# EAGLE design apollobvm_pcb_mill (EAGLE 9.6.0)
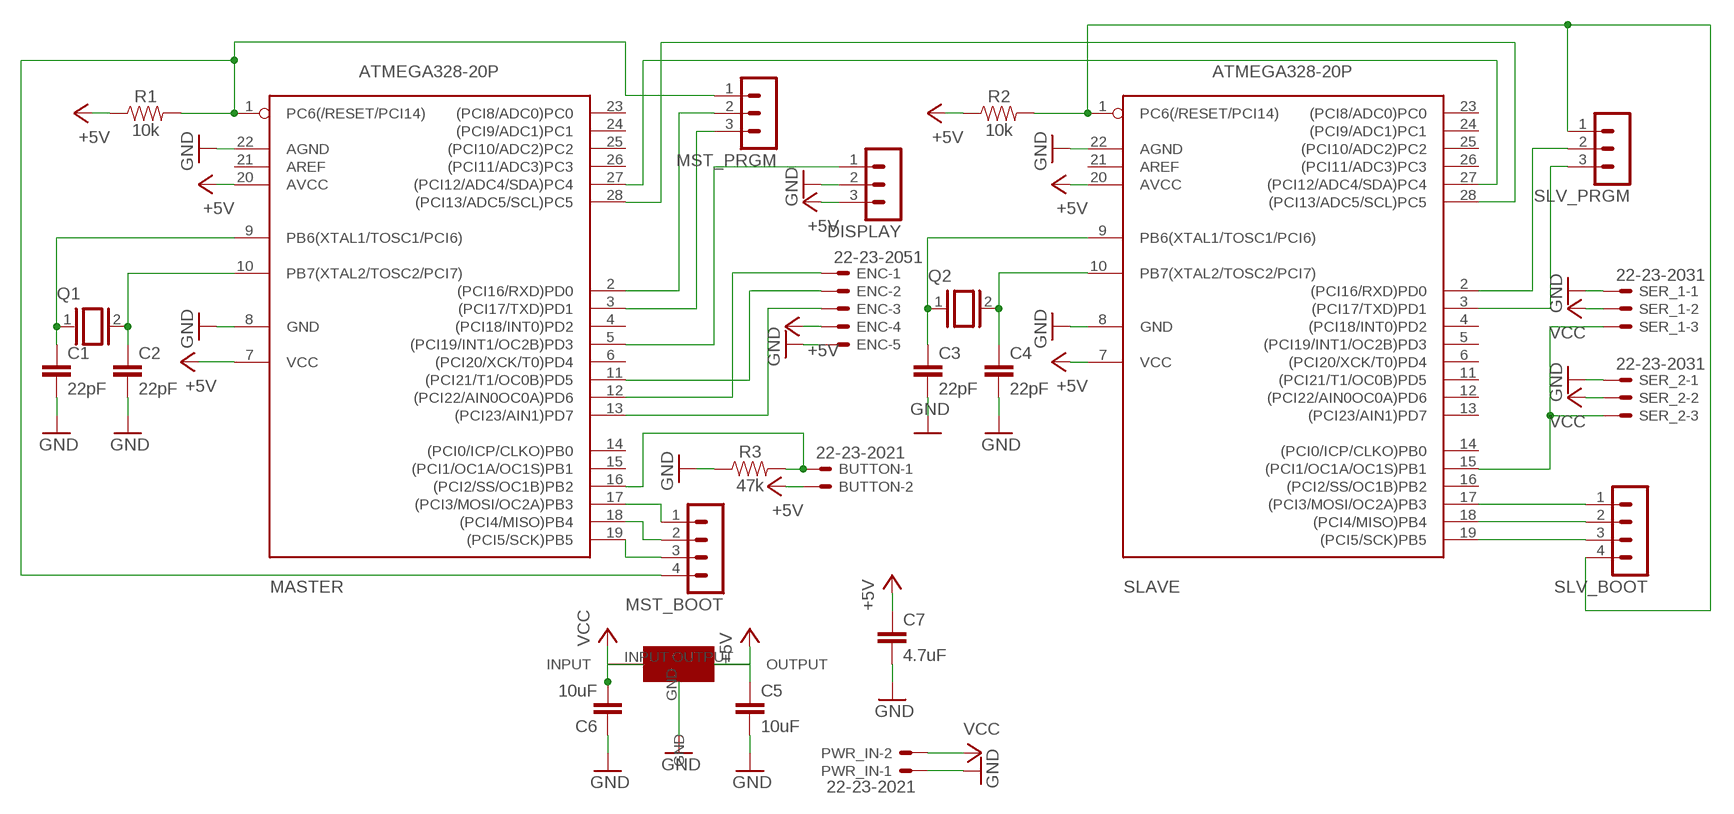
[diagram p0: schematic, sheet 1]

## Parts
BUTTON  22-23-2021  [22-23-2021]
C1  22pF  22PF-0603-50V-5%  [0603]
C2  22pF  22PF-0603-50V-5%  [0603]
C3  22pF  22PF-0603-50V-5%  [0603]
C4  22pF  22PF-0603-50V-5%  [0603]
C5  10uF  10UF-0603-6.3V-20%  [0603]
C6  10uF  10UF-0603-6.3V-20%  [0603]
C7  4.7uF  4.7UF0603  [0603]
DISPLAY  MA03-1  [MA03-1]
ENC  22-23-2051  [22-23-2051]
MASTER  ATMEGA328-20P  [DIL28-3]
MST_BOOT  MA04-1  [MA04-1]
MST_PRGM  MA03-1  [MA03-1]
PWR_IN  22-23-2021  [22-23-2021]
Q1  XTAL/S  [QS]
Q2  XTAL/S  [QS]
R1  10k  10KOHM-0603-1/10W-1%  [0603]
R2  10k  10KOHM-0603-1/10W-1%  [0603]
R3  47k  47KOHM-0603-1/10W-1%  [0603]
SER_1  22-23-2031  [22-23-2031]
SER_2  22-23-2031  [22-23-2031]
SLAVE  ATMEGA328-20P  [DIL28-3]
SLV_BOOT  MA04-1  [MA04-1]
SLV_PRGM  MA03-1  [MA03-1]
U$1  NCP1117  [NCP1117]

## Nets
+5V: BUTTON.2 C5.1 C7.1 DISPLAY.3 ENC.4 MASTER.7(VCC) MASTER.20(AVCC) R1.1 R2.1 SLAVE.7(VCC) SLAVE.20(AVCC) U$1.OUTPUT
GND: C1.2 C2.2 C3.2 C4.2 C5.2 C6.1 C7.2 DISPLAY.2 ENC.5 MASTER.8(GND) MASTER.22(AGND) PWR_IN.1 R3.1 SER_1.1 SER_2.1 SLAVE.8(GND) SLAVE.22(AGND) U$1.GND
N$1: MASTER.1(PC6(/RESET/PCI14)) MST_BOOT.4 MST_PRGM.1 R1.2
N$2: R2.2 SLAVE.1(PC6(/RESET/PCI14)) SLV_BOOT.4 SLV_PRGM.1
N$3: C3.1 Q2.1 SLAVE.9(PB6(XTAL1/TOSC1/PCI6))
N$4: C4.1 Q2.2 SLAVE.10(PB7(XTAL2/TOSC2/PCI7))
N$5: C1.1 MASTER.9(PB6(XTAL1/TOSC1/PCI6)) Q1.1
N$6: C2.1 MASTER.10(PB7(XTAL2/TOSC2/PCI7)) Q1.2
N$7: SER_1.3 SER_2.3 SLAVE.15((PCI1/OC1A/OC1S)PB1)
N$8: DISPLAY.1 MASTER.5((PCI19/INT1/OC2B)PD3)
N$9: ENC.3 MASTER.13((PCI23/AIN1)PD7)
N$10: ENC.2 MASTER.11((PCI21/T1/OC0B)PD5)
N$11: MASTER.27((PCI12/ADC4/SDA)PC4) SLAVE.27((PCI12/ADC4/SDA)PC4)
N$12: ENC.1 MASTER.12((PCI22/AIN0OC0A)PD6)
N$13: MASTER.28((PCI13/ADC5/SCL)PC5) SLAVE.28((PCI13/ADC5/SCL)PC5)
N$14: BUTTON.1 MASTER.16((PCI2/SS/OC1B)PB2) R3.2
N$15: SLAVE.17((PCI3/MOSI/OC2A)PB3) SLV_BOOT.1
N$16: SLAVE.18((PCI4/MISO)PB4) SLV_BOOT.2
N$17: SLAVE.19((PCI5/SCK)PB5) SLV_BOOT.3
N$18: MASTER.17((PCI3/MOSI/OC2A)PB3) MST_BOOT.1
N$19: MASTER.18((PCI4/MISO)PB4) MST_BOOT.2
N$20: MASTER.19((PCI5/SCK)PB5) MST_BOOT.3
N$22: SLAVE.2((PCI16/RXD)PD0) SLV_PRGM.2
N$23: SLAVE.3((PCI17/TXD)PD1) SLV_PRGM.3
N$24: MASTER.2((PCI16/RXD)PD0) MST_PRGM.2
N$25: MASTER.3((PCI17/TXD)PD1) MST_PRGM.3
VCC: C6.2 PWR_IN.2 SER_1.2 SER_2.2 U$1.INPUT
Unconnected: MASTER.4((PCI18/INT0)PD2) MASTER.6((PCI20/XCK/T0)PD4) MASTER.14((PCI0/ICP/CLKO)PB0) MASTER.15((PCI1/OC1A/OC1S)PB1) MASTER.21(AREF) MASTER.23((PCI8/ADC0)PC0) MASTER.24((PCI9/ADC1)PC1) MASTER.25((PCI10/ADC2)PC2) MASTER.26((PCI11/ADC3)PC3) SLAVE.4((PCI18/INT0)PD2) SLAVE.5((PCI19/INT1/OC2B)PD3) SLAVE.6((PCI20/XCK/T0)PD4) SLAVE.11((PCI21/T1/OC0B)PD5) SLAVE.12((PCI22/AIN0OC0A)PD6) SLAVE.13((PCI23/AIN1)PD7) SLAVE.14((PCI0/ICP/CLKO)PB0) SLAVE.16((PCI2/SS/OC1B)PB2) SLAVE.21(AREF) SLAVE.23((PCI8/ADC0)PC0) SLAVE.24((PCI9/ADC1)PC1) SLAVE.25((PCI10/ADC2)PC2) SLAVE.26((PCI11/ADC3)PC3)

## Library data of the parts
BUTTON PWR_IN = con-molex:22-23-2021: .100" (2.54mm) Center Header - 2 Pin; MF: MOLEX; MPN: 22-23-2021; OC_FARNELL: 1462926; OC_NEWARK: 25C3832
C1-C4 = SparkFun-Capacitors:22PF: 22pF ceramic capacitors A capacitor is a passive two-terminal electrical component used to store electrical energy temporarily in an electric field.; PROD_ID: CAP-07876
C5 C6 = SparkFun-Capacitors:10UF: 10.0µF ceramic capacitors A capacitor is a passive two-terminal electrical component used to store electrical energy temporarily in an electric field.; PROD_ID: CAP-11015
C7 = SparkFun-Capacitors:4.7UF: 4.7µF ceramic capacitors A capacitor is a passive two-terminal electrical component used to store electrical energy temporarily in an electric field.; PROD_ID: CAP-08280
DISPLAY MST_PRGM SLV_PRGM = con-lstb:MA03-1: PIN HEADER; OC_FARNELL: unknown; OC_NEWARK: unknown
ENC = con-molex:22-23-2051: .100" (2.54mm) Center Header - 5 Pin; MF: MOLEX; MPN: 22-23-2051; OC_FARNELL: 1462952; OC_NEWARK: 38C9178
MASTER SLAVE = atmega328:ATMEGA328*P: MICROCONTROLLER 32 kBytes FLASH 2 kBytes SRAM 1 kBytes EEPROM USART 8-channel 10 bit ADC
MST_BOOT SLV_BOOT = con-lstb:MA04-1: PIN HEADER; OC_FARNELL: unknown; OC_NEWARK: unknown
Q1 Q2 = apollobvm_pcb:XTAL/S: CRYSTAL
R1 R2 = SparkFun-Resistors:10KOHM: 10kΩ resistor A resistor is a passive two-terminal electrical component that implements electrical resistance as a circuit element. Resistors act to reduce current flow, and, at the same time, act to lower voltage levels within circuits. - Wikipedia; PROD_ID: RES-00824
R3 = SparkFun-Resistors:47KOHM: 47kΩ resistor A resistor is a passive two-terminal electrical component that implements electrical resistance as a circuit element. Resistors act to reduce current flow, and, at the same time, act to lower voltage levels within circuits. - Wikipedia; PROD_ID: RES-07871
SER_1 SER_2 = con-molex:22-23-2031: .100" (2.54mm) Center Header - 3 Pin; MF: MOLEX; MPN: 22-23-2031; OC_FARNELL: 1462950; OC_NEWARK: 30C0862
U$1 = apollobvm_pcb:NCP1117

## Board
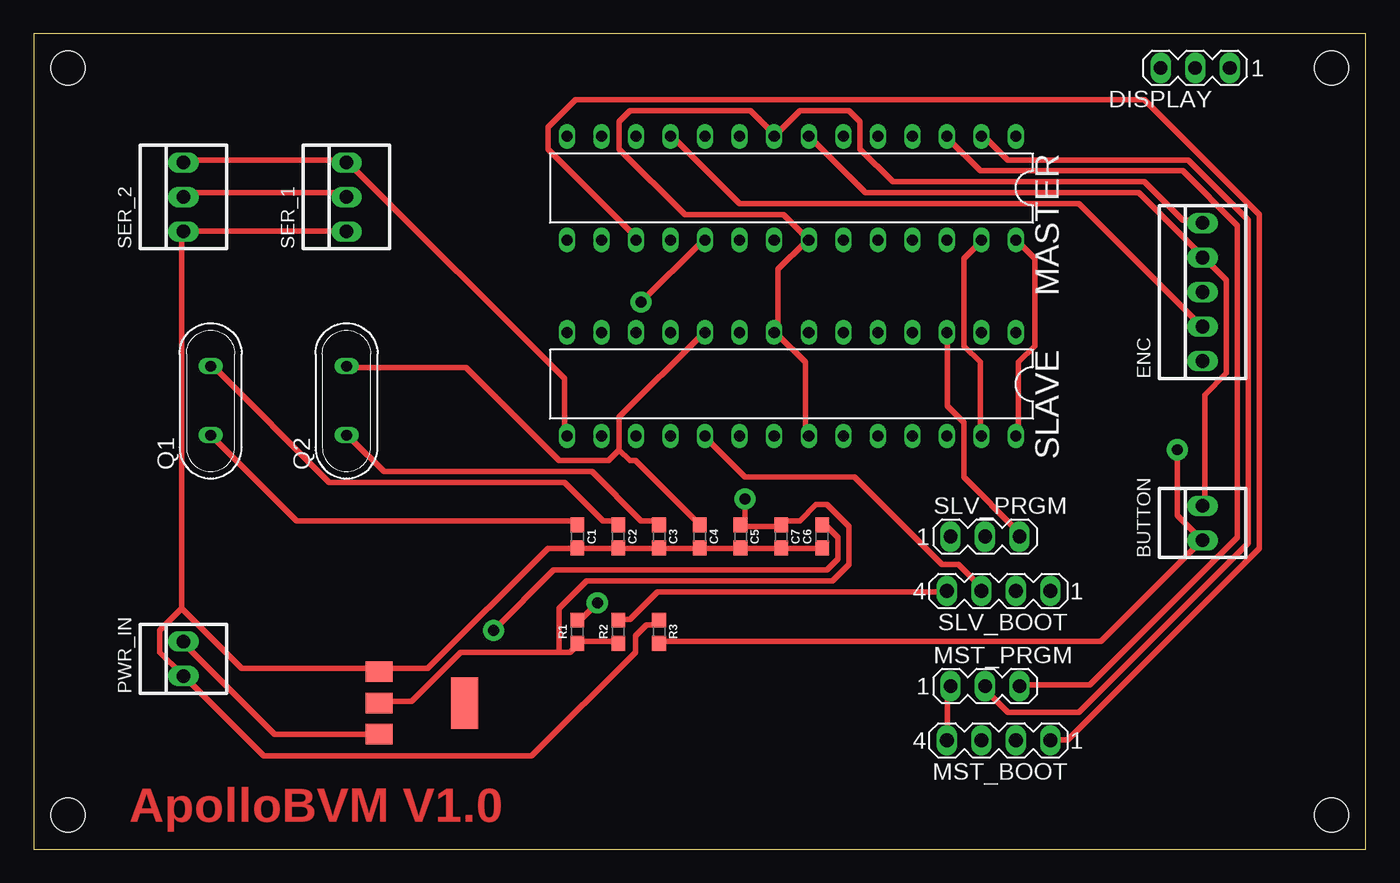
[diagram p1: board, top side]
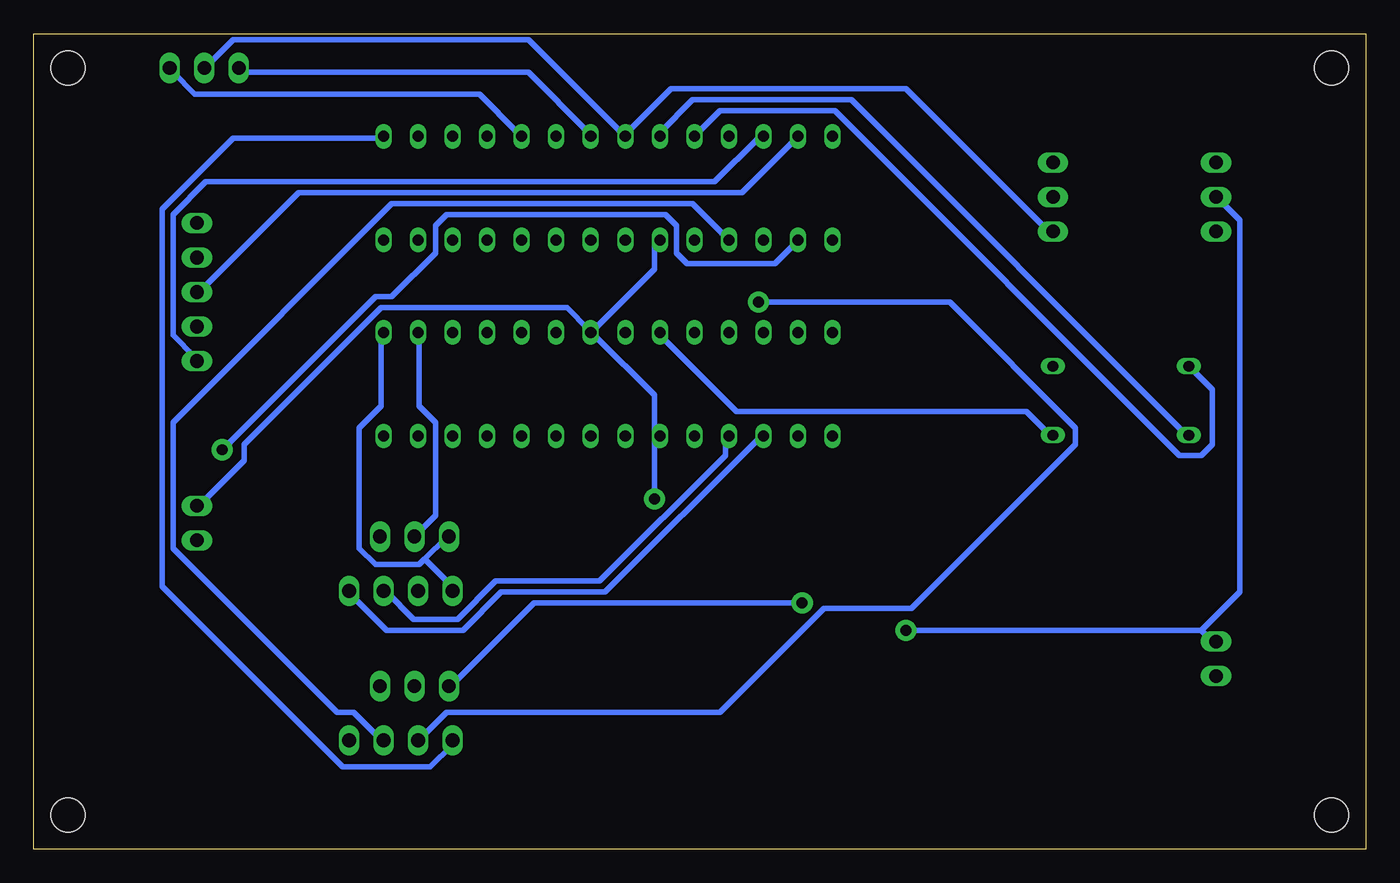
[diagram p2: board, bottom side, seen from below]

Size 98 x 60 mm. Coordinates in mm from the lower left corner, seen from the top.
Outline: 0,0 98,0 98,60 0,60 0,0
Copper layers (1*16): Top 0.035mm / dielectric 1.5mm / Bottom 0.035mm
Design rules "OthermillDRC_1_64_v2 *": minimum track width 16mil, minimum drill 0.8mm, track to track 0.39878125mm, track to pad 0.39878125mm, pad to pad 0.39878125mm, via to via 0.39878125mm, smd to smd 0mil, copper to edge 0mil, drill to drill 1mil, minimum pad ring 0mil, minimum via ring 15mil, stop-mask expansion 1mil, vias tented up to drill 30mil, thermal gap 10mil
Holes 2.5 mm at 2.5,2.5 2.5,57.5 95.5,57.5 95.5,2.5

### Footprints (pad centres in the part's own frame; a part is rotated, then mirrored left to right if it is on the bottom)
22-23-2021 = drill 1 long: 1 -1.27,0; 2 1.27,0
0603 = smd 1.1 x 1: 1 -0.85,0; 2 0.85,0
MA03-1 = drill 1.016 long: 1 -2.54,0; 2 0,0; 3 2.54,0
22-23-2051 = drill 1 long: 1 -5.08,0; 2 -2.54,0; 3 0,0; 4 2.54,0; 5 5.08,0
DIL28-3 = drill 0.813 long: 1 -16.51,-3.81; 2 -13.97,-3.81; 3 -11.43,-3.81; 4 -8.89,-3.81; 5 -6.35,-3.81; 6 -3.81,-3.81; 7 -1.27,-3.81; 8 1.27,-3.81; 9 3.81,-3.81; 10 6.35,-3.81; 11 8.89,-3.81; 12 11.43,-3.81; 13 13.97,-3.81; 14 16.51,-3.81; 15 16.51,3.81; 16 13.97,3.81; 17 11.43,3.81; 18 8.89,3.81; 19 6.35,3.81; 20 3.81,3.81; 21 1.27,3.81; 22 -1.27,3.81; 23 -3.81,3.81; 24 -6.35,3.81; 25 -8.89,3.81; 26 -11.43,3.81; 27 -13.97,3.81; 28 -16.51,3.81
MA04-1 = drill 1.016 long: 1 -3.81,0; 2 -1.27,0; 3 1.27,0; 4 3.81,0
QS = drill 0.8 long: 1 -2.54,0; 2 2.54,0
22-23-2031 = drill 1 long: 1 -2.54,0; 2 0,0; 3 2.54,0
NCP1117 = smd 1.5 x 2: GND -2.3,0; INPUT 2.3,0; OUTPUT 0,0 | smd 3.8 x 2: TAB 0,6.3

### Placement (x,y rotation side)
BUTTON  86,24 90 top
C1  40,23 270 top
C2  43,23 270 top
C3  46,23 270 top
C4  49,23 270 top
C5  52,23 270 top
C6  58,23 90 top
C7  55,23 270 top
DISPLAY  85.46,57.5 180 top
ENC  86,41 90 top
MASTER  55.75,48.65 180 top
MST_BOOT  71,8 180 top
MST_PRGM  70,12 0 top
PWR_IN  11,14 90 top
Q1  13,33 90 top
Q2  23,33 90 top
R1  40,16 90 top
R2  43,16 90 top
R3  46,16 270 top
SER_1  23,48 90 top
SER_2  11,48 90 top
SLAVE  55.75,34.22 180 top
SLV_BOOT  71,19 180 top
SLV_PRGM  70,23 0 top
U$1  25.4,10.75 270 top

### Tracks (layer width: path | path; a pad name or v marks a point on that pad's centre or on a via)
+5V  (via drill 0.8)
  Top 0.406: R2.1 42.67,15.3 40.26,15.3 R1.1 39.86,14.9 39.45,14.49 38.65,14.49 | 38.65,14.49 31.4,14.49 27.78,10.87 25.77,10.87 U$1.OUTPUT | 38.65,14.49 38.65,17.71 40.66,19.73 58.78,19.73 59.99,20.93 59.99,23.75 58.38,25.36 57.57,25.36 56.36,24.16 55.16,24.16 C7.1 54.75,23.75 52.34,23.75 C5.1 52.34,24.16 v52.34,25.77 | BUTTON.2 86.15,25.36 86.15,33.41 87.77,35.02 87.77,41.87 86.15,43.48 ENC.4 85.75,43.88 81.32,48.31 61.19,48.31 57.17,52.34 MASTER.7
  Bottom 0.406: MASTER.7 57.17,52.74 61.6,57.17 82.53,57.17 DISPLAY.3 | SLAVE.7 56.77,37.84 52.34,33.41 52.34,30.6 SLAVE.20 52.34,30.19 v52.34,25.77 | MASTER.20 52.34,44.69 52.34,42.67 56.77,38.25 SLAVE.7 | SLAVE.7 57.17,38.25 58.78,39.86 72.47,39.86 82.53,29.79 82.53,28.58 85.75,25.36 BUTTON.2
GND
  Top 0.406: SLAVE.22 56.77,30.6 56.77,35.83 54.75,37.84 SLAVE.8 54.75,38.25 54.75,42.67 56.77,44.69 MASTER.22 56.77,45.09 55.16,46.7 47.91,46.7 43.08,51.53 43.08,53.55 43.88,54.35 52.74,54.35 54.35,52.74 MASTER.8 54.75,52.74 56.36,54.35 59.99,54.35 60.79,53.55 60.79,51.53 63.21,49.12 81.73,49.12 84.54,46.3 85.75,46.3 ENC.5 | C6.1 57.97,22.14 55.16,22.14 C7.2 54.75,22.14 52.34,22.14 C5.2 51.93,22.14 49.12,22.14 C4.2 48.71,22.14 46.3,22.14 C3.2 45.9,22.14 43.08,22.14 C2.2 42.67,22.14 40.26,22.14 C1.2 39.86,22.14 37.84,22.14 28.99,13.29 25.77,13.29 U$1.GND 25.36,13.29 15.3,13.29 10.87,17.71 | SER_1.1 22.95,45.49 11.27,45.49 SER_2.1 10.87,45.09 10.87,17.71 | R3.1 45.9,16.51 45.09,16.51 44.28,15.7 44.28,14.49 36.64,6.84 16.91,6.84 11.27,12.48 PWR_IN.1 10.87,12.88 9.26,14.49 9.26,16.1 10.87,17.71
  Bottom 0.406: DISPLAY.2 85.35,57.57 83.34,59.58 61.6,59.58 54.75,52.74 MASTER.8 54.35,52.74 51.13,55.96 33.82,55.96 23.35,45.49 SER_1.1
N$1  (via drill 0.8)
  Top 0.406: v41.47,18.12 40.26,16.91 R1.2 | MST_PRGM.1 67.23,11.68 67.23,8.05 MST_BOOT.4
  Bottom 0.406: v41.47,18.12 61.19,18.12 67.23,12.08 MST_PRGM.1 | MASTER.1 72.47,52.34 83.34,52.34 88.57,47.1 88.57,19.32 75.28,6.04 68.84,6.04 67.23,7.65 MST_BOOT.4
N$2
  Top 0.406: R2.2 43.08,16.91 43.88,16.91 45.9,18.92 66.83,18.92 SLV_BOOT.4
  Bottom 0.406: 69.25,21.34 67.64,22.95 SLV_PRGM.1 | 69.25,21.34 69.65,20.93 72.87,20.93 74.08,22.14 74.08,31 72.47,32.61 72.47,37.84 SLAVE.1 | 69.25,21.34 67.23,19.32 SLV_BOOT.4
N$3
  Top 0.406: C3.1 45.9,24.16 44.69,24.16 41.06,27.78 25.77,27.78 23.35,30.19 Q2.1
  Bottom 0.406: SLAVE.9 51.93,37.84 46.3,32.21 24.96,32.21 23.35,30.6 Q2.1
N$4
  Top 0.406: 43.08,29.39 43.88,28.58 44.28,28.58 48.71,24.16 C4.1 | 43.08,29.39 43.08,31.8 49.12,37.84 SLAVE.10 | 43.08,29.39 42.27,28.58 38.65,28.58 31.8,35.43 23.35,35.43 Q2.2
N$5
  Top 0.406: C1.1 39.86,24.16 19.32,24.16 13.29,30.19 Q1.1
  Bottom 0.406: MASTER.9 51.93,52.74 49.52,55.16 37.84,55.16 13.29,30.6 Q1.1
N$6
  Top 0.406: C2.1 42.67,24.16 41.87,24.16 39.05,26.97 21.74,26.97 13.29,35.43 Q1.2
  Bottom 0.406: MASTER.10 49.12,52.74 47.51,54.35 39.05,54.35 13.69,28.99 12.08,28.99 11.27,29.79 11.27,33.82 12.88,35.43 Q1.2
N$7
  Top 0.406: SLAVE.15 39.05,30.6 39.05,34.62 23.35,50.32 SER_1.3 22.95,50.73 11.27,50.73 SER_2.3
N$8
  Bottom 0.406: MASTER.5 62.4,52.74 65.22,55.56 86.15,55.56 87.77,57.17 DISPLAY.1
N$9
  Bottom 0.406: MASTER.13 41.87,52.34 45.9,48.31 78.5,48.31 85.75,41.06 ENC.3
N$10
  Top 0.406: MASTER.11 47.1,52.34 51.93,47.51 76.89,47.51 85.75,38.65 ENC.2
N$11
  Top 0.406: SLAVE.27 69.65,30.6 69.65,35.83 68.44,37.04 68.44,43.48 69.65,44.69 MASTER.27
N$12
  Bottom 0.406: MASTER.12 44.69,52.34 47.91,49.12 85.35,49.12 87.77,46.7 87.77,37.84 86.15,36.23 ENC.1
N$13
  Top 0.406: SLAVE.28 72.47,30.6 72.47,35.83 73.67,37.04 73.67,43.48 72.47,44.69 MASTER.28
N$14  (via drill 0.8)
  Top 0.406: R3.2 46.3,15.3 78.5,15.3 85.75,22.55 BUTTON.1 85.75,22.95 84.14,24.56 v84.14,29.39
  Bottom 0.406: v84.14,29.39 72.87,40.66 71.66,40.66 68.44,43.88 68.44,45.9 67.64,46.7 51.53,46.7 50.73,45.9 50.73,43.88 49.92,43.08 43.48,43.08 41.87,44.69 MASTER.16
N$15
  Bottom 0.406: SLAVE.17 44.69,30.19 55.96,18.92 63.61,18.92 66.43,16.1 72.06,16.1 74.88,18.92 SLV_BOOT.1
N$16
  Bottom 0.406: SLAVE.18 47.1,30.19 47.1,28.99 56.36,19.73 64.01,19.73 66.83,16.91 70.05,16.91 72.06,18.92 SLV_BOOT.2
N$17
  Top 0.406: SLAVE.19 49.52,30.19 52.34,27.38 60.39,27.38 66.83,20.93 68.04,20.93 69.65,19.32 SLV_BOOT.3
N$18
  Top 0.406: MASTER.17 44.28,45.09 37.84,51.53 37.84,53.14 39.86,55.16 81.73,55.16 90.18,46.7 90.18,22.14 76.09,8.05 74.88,8.05 MST_BOOT.1
N$19
  Bottom 0.406: MASTER.18 47.1,45.09 49.52,47.51 71.66,47.51 87.77,31.4 87.77,22.14 75.69,10.06 74.48,10.06 72.47,8.05 MST_BOOT.2
N$20  (via drill 0.8)
  Top 0.406: v44.69,40.26 49.12,44.69 MASTER.19
  Bottom 0.406: v44.69,40.26 30.6,40.26 21.34,31 21.34,29.79 33.41,17.71 39.86,17.71 47.51,10.06 67.64,10.06 69.65,8.05 MST_BOOT.3
N$22
  Bottom 0.406: SLAVE.2 69.65,37.84 69.65,32.61 68.44,31.4 68.44,24.56 69.65,23.35 SLV_PRGM.2
N$23
  Top 0.406: SLAVE.3 67.23,37.84 67.23,32.61 68.44,31.4 68.44,27.38 72.47,23.35 SLV_PRGM.3
N$24
  Top 0.406: MASTER.2 70.05,52.34 71.66,50.73 84.95,50.73 89.38,46.3 89.38,22.55 76.89,10.06 71.66,10.06 70.05,11.68 MST_PRGM.2
N$25
  Top 0.406: MASTER.3 67.23,52.34 69.65,49.92 84.54,49.92 88.57,45.9 88.57,22.95 77.7,12.08 72.87,12.08 MST_PRGM.3
VCC  (via drill 0.8)
  Top 0.406: SER_2.2 11.27,48.31 22.95,48.31 SER_1.2 | v33.82,16.1 38.25,20.53 58.38,20.53 59.18,21.34 59.18,22.95 58.38,23.75 C6.2 | U$1.INPUT 25.36,8.45 17.71,8.45 11.27,14.9 PWR_IN.2
  Bottom 0.406: 12.08,16.1 v33.82,16.1 | 12.08,16.1 11.27,15.3 PWR_IN.2 | 12.08,16.1 9.26,18.92 9.26,46.3 10.87,47.91 SER_2.2

### Text on the board
Top: ApolloBVM V1.0